# Altium schematic sheet rs485.SchDoc
size A
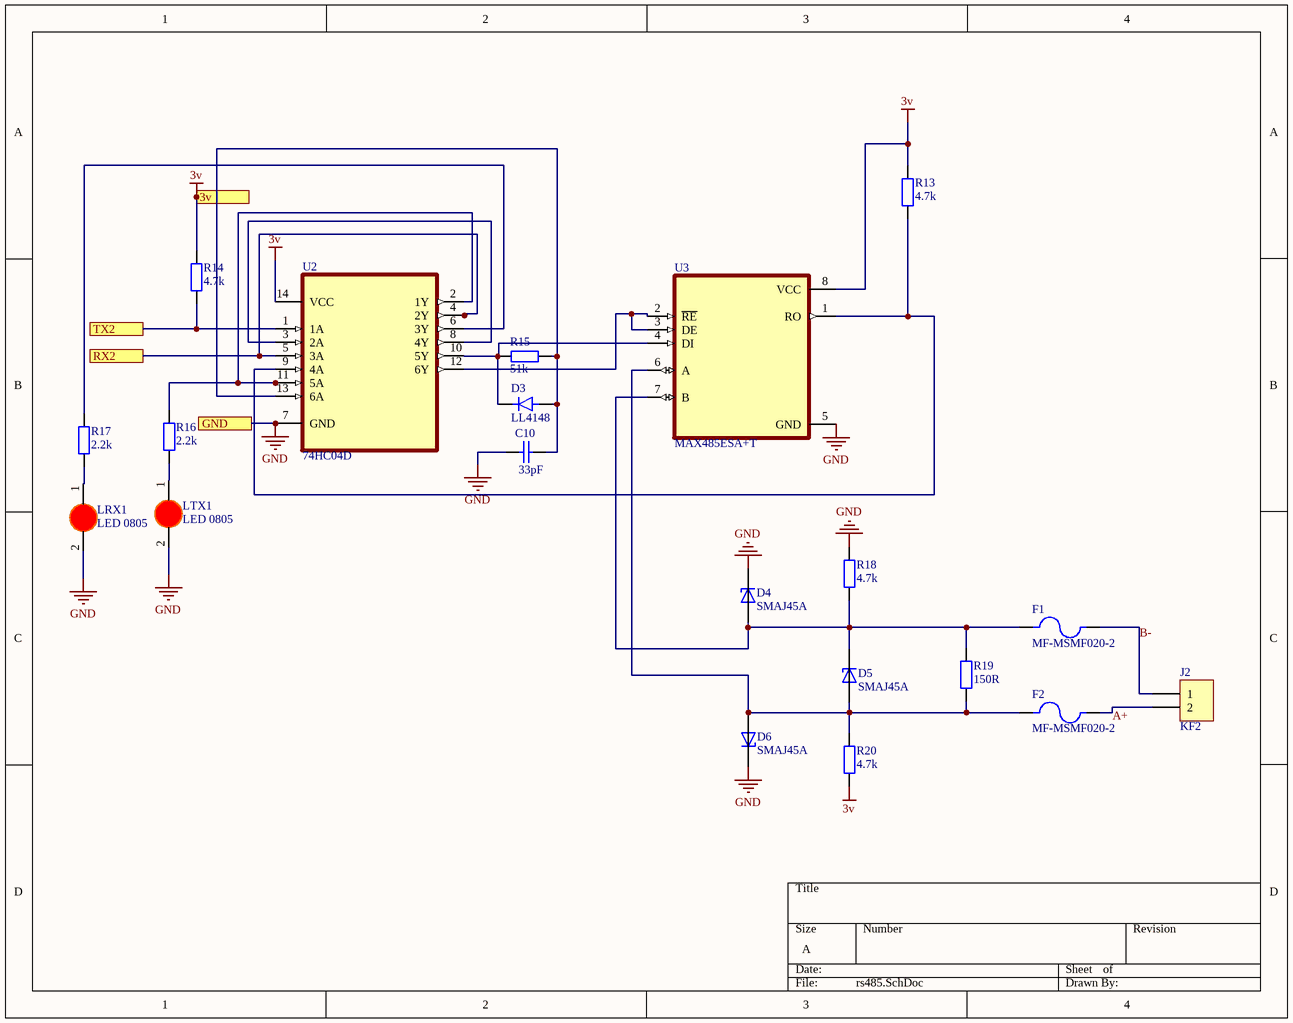
[diagram p0: rs485.SchDoc]

## Parts
C10  33pF  [tu 0805]
D3  LL4148  [DIO_LL4148]
D4  SMAJ45A  [DIOM4325X250N]
D5  SMAJ45A  [DIOM4325X250N]
D6  SMAJ45A  [DIOM4325X250N]
F1  MF-MSMF020-2  [FUSER_MF-MSMF020-2]
F2  MF-MSMF020-2  [FUSER_MF-MSMF020-2]
J2  KF2  [KF2-3.5]
LRX1  LED 0805  [LED-0805-Red]
LTX1  LED 0805  [LED-0805-Red]
R13  4.7k  [tro smd 0603]
R14  4.7k  [tro smd 0603]
R15  51k  [tro smd 0603]
R16  2.2k  [tro smd 0603]
R17  2.2k  [tro smd 0603]
R18  4.7k  [tro smd 0603]
R19  150R  [tro smd 0603]
R20  4.7k  [tro smd 0603]
U2  74HC04D  [SOIC127P600X175-14N]
U3  MAX485ESA+T  [SOIC127P600X175-8N]

## Ports
3v, GND, RX2, TX2

## Nets
3v: R13.2 R14.2 R20.1 U2.14(VCC) U3.8(VCC) ; port 3v
GND: C10.2 D4.C D6.C LRX1.2(K) LTX1.2(K) R18.2 U2.7(GND) U3.5(GND) ; port GND
A+: F2.2 J2.2
B-: F1.2 J2.1
RX2: U2.4(2Y) U2.5(3A) ; port RX2
TX2: R14.1 U2.1(1A) ; port TX2
NetC10_1: C10.1 D3.A R15.2 U2.13(6A)
NetD3_C: D3.C R15.1 U2.10(5Y) U3.4(DI)
NetD4_A: D4.A D5.C F1.1 R18.1 R19.2 U3.7(B)
NetD5_A: D5.A D6.A F2.1 R19.1 R20.2 U3.6(A)
NetLRX1_1: LRX1.1(A) R17.1
NetLTX1_1: LTX1.1(A) R16.1
NetR13_1: R13.1 U2.9(4A) U3.1(RO)
NetR16_2: R16.2 U2.2(1Y) U2.11(5A)
NetR17_2: R17.2 U2.6(3Y)
NetU2_3: U2.3(2A) U2.8(4Y)
NetU2_12: U2.12(6Y) U3.2(~{RE}) U3.3(DE)

## Library data of the parts
C10 = Tu 0805 33pF 50V 10%: Dán; Don_Vi: Con; So_Chan: 2; Ten_Linh_Kien: Tụ 0805 33p 10% 50V; Ma_Hang: MH004563; Chung_Loai: Dán; Kieu_Chan: *
D3 = LL4148: Diode Small Signal Switching 100V 0.15A Automotive 2-Pin Mini-MELF T/R; MF: Diotec Semiconductor; Value: *; SnapEDA_Link: https://www.snapeda.com/parts/LL4148/Diotec/view-part/?ref=snap; Purchase-URL: https://pricing.snapeda.com/search/part/LL4148/?ref=eda; Availability: In Stock; Price: None; Package: MINIMELF-2 Diotec; Check_prices: https://www.snapeda.com/parts/LL4148/Diotec/view-part/?ref=eda; MP: LL4148
D4-D6 = SMAJ45A: 72.7V Clamp 5.5A Ipp Tvs Diode Surface Mount DO-214AC (SMA); MF: Littelfuse; Value: *; Check_prices: https://www.snapeda.com/parts/SMAJ45A/Littelfuse/view-part/?ref=eda; Package: DO-214; Availability: Unavailable; SnapEDA_Link: https://www.snapeda.com/parts/SMAJ45A/Littelfuse/view-part/?ref=snap; MP: SMAJ45A; Price: None
F1 F2 = MF-MSMF020-2: Polymeric PTC Resettable Fuse 30V 200 mA Ih Surface Mount 1812 (4532 Metric), Concave; MF: Bourns; Package: 1812 Bourns; Price: None; MP: MF-MSMF020-2; Availability: In Stock; Value: *; Check_prices: https://www.snapeda.com/parts/MF-MSMF020-2/Bourns/view-part/?ref=eda; Purchase-URL: https://pricing.snapeda.com/search/part/MF-MSMF020-2/?ref=eda; SnapEDA_Link: https://www.snapeda.com/parts/MF-MSMF020-2/Bourns/view-part/?ref=snap
J2 = KF2: Manufacturer: Würth Elektronik eiSos GmbH; partNo: 691103110002; ComponentLink1 Description: Manufacturer; ComponentLink2 Description: Datasheet; NoPins: 2; Created Date: 29 October 2013; ComponentLink1URL: http://www.we-online.com; ComponentLink2URL: http://katalog.we-online.de/em/datasheet/6911031100xx.pdf; Created by: Karrer Zheng
LRX1 LTX1 = LED 0805 Do: Dán; Don_Vi: Con; Ma_Hang: MH000897; Ten_Linh_Kien: LED 0805 Màu Đỏ (Red); Ghi_Chu: *; Kieu_Chan: *; Chung_Loai: Dán
R13 R14 R18 R20 = Tro 0603 5% 4.7k: Dán; Don_Vi: Con; So_Chan: 2; Ten_Linh_Kien: Trở 0603 5% 4.7k; Ma_Hang: MH006327; Chung_Loai: Dán; Kieu_Chan: *
R15 = Tro 0603 5% 51k: Dán; Don_Vi: Con; So_Chan: 2; Ten_Linh_Kien: Trở 0603 5% 51k; Ma_Hang: MH007666; Chung_Loai: Dán; Kieu_Chan: *
R16 R17 = Tro 0603 5% 2.2k: Dán; Don_Vi: Con; So_Chan: 2; Ten_Linh_Kien: Trở 0603 5% 2.2k; Ma_Hang: MH006321; Chung_Loai: Dán; Kieu_Chan: *
R19 = Tro 0603 5% 150R: Dán; Don_Vi: Con; So_Chan: 2; Ten_Linh_Kien: Trở 0603 5% 150R; Ma_Hang: MH006318; Chung_Loai: Dán; Kieu_Chan: *
U2 = 74HC04D: Inverter IC 6 Channel 14-SOIC; MF: Toshiba; Value: *; MP: 74HC04D; Package: SOIC-14 NXP Semiconductors; Price: None; Availability: Unavailable; SnapEDA_Link: https://www.snapeda.com/parts/74HC04D/Toshiba%20Semiconductor%20and%20Storage/view-part/1040011/?ref=snap
U3 = MAX485ESA+T: 1/1 Transceiver Half RS422, RS485 8-SOIC; MF: Maxim Integrated; MP: MAX485ESA; SnapEDA_Link: https://www.snapeda.com/parts/MAX485ESA/Maxim+Integrated/view-part/?ref=snap; Purchase-URL: https://pricing.snapeda.com/search/part/MAX485ESA/?ref=eda; Value: *; Package: SOIC-8 Maxim; Price: None; Availability: In Stock; Check_prices: https://www.snapeda.com/parts/MAX485ESA/Maxim+Integrated/view-part/?ref=eda